# EAGLE schematic tps1 (EAGLE 6.5.0)
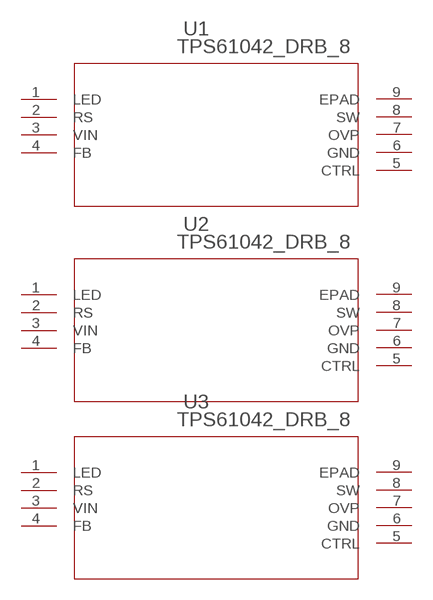
[diagram p0: schematic, sheet 1]

## Parts
U1  TPS61042_DRB_8  [DRB8_1P75X1P5]
U2  TPS61042_DRB_8  [DRB8_1P75X1P5]
U3  TPS61042_DRB_8  [DRB8_1P75X1P5]
Unconnected: U1.1(LED) U1.2(RS) U1.3(VIN) U1.4(FB) U1.5(CTRL) U1.7(OVP) U1.8(SW) U1.9(EPAD) U2.1(LED) U2.2(RS) U2.3(VIN) U2.4(FB) U2.5(CTRL) U2.7(OVP) U2.8(SW) U2.9(EPAD) U3.1(LED) U3.2(RS) U3.3(VIN) U3.4(FB) U3.5(CTRL) U3.7(OVP) U3.8(SW) U3.9(EPAD)

## Power pins joined to a net without a drawn wire
GND: U1.6(GND) U2.6(GND) U3.6(GND)

## Library data of the parts
U1-U3 = tps61042:TPS61042_DRB_8; DATASHEETURL: http://www.ti.com/lit/gpn/TPS61042; DESCRIPTION: 30-V, 500-mA Switch Boost Converter in QFN-8 for White LED Applications; FAMILY_NAME: WHITE LED DRIVER; GENERIC_PART_NUMBER: TPS61042; INDUSTRY_STD_PKG_TYPE: SON; MANUFACTURER: Texas Instruments; MANUFACTURER_PART_NUMBER: tps61042_drb_8; PACKAGE_DESIGNATOR: DRB; PIN_COUNT: 8; VENDOR: Texas Instruments